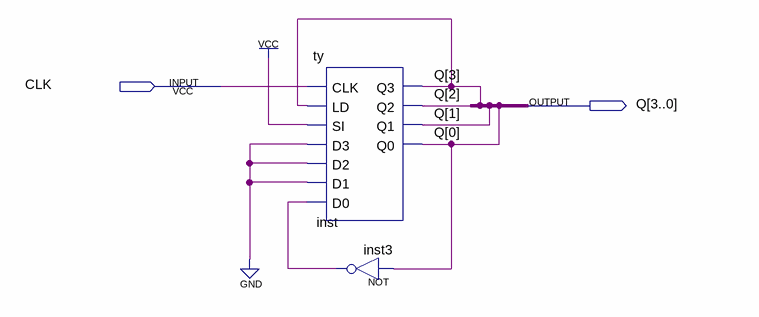
[diagram p0: schematic sheet]
// Quartus schematic desl.bdf as structural Verilog: 2 symbols, 2 pins
module desl (
  input  CLK,
  output [3:0] Q
);

  wire inst3_out;

  ty inst (
    .CLK(CLK), .LD(Q[3]), .SI(1'b1), .D3(1'b0), .D2(1'b0), .D1(1'b0), .D0(inst3_out), .Q3(Q[3]), .Q2(Q[2]),
    .Q1(Q[1]), .Q0(Q[0]));
  not inst3 (inst3_out, Q[0]);
endmodule
